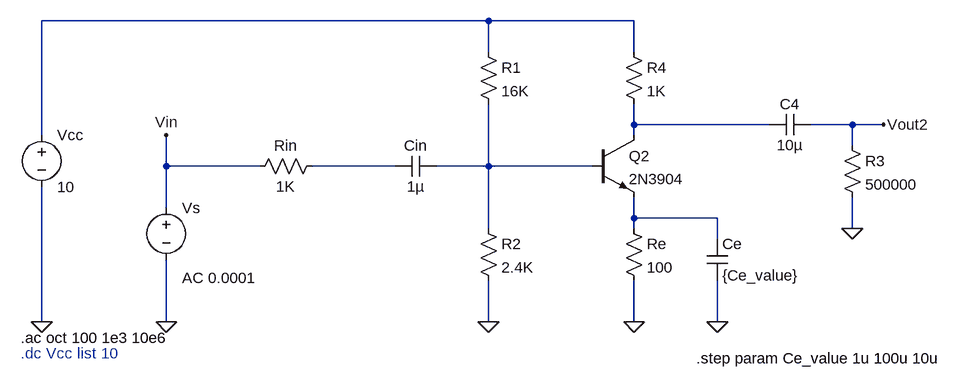
[diagram p0: schematic transistor_common_emitter_ex_ac_gain.asc]
transistor_common_emitter_ex_ac_gain.asc, the LTspice schematic file:
Version 4
SHEET 1 1368 680
WIRE 240 32 -448 32
WIRE 464 32 240 32
WIRE 240 80 240 32
WIRE 464 80 464 32
WIRE 464 192 464 160
WIRE 672 192 464 192
WIRE 800 192 736 192
WIRE 848 192 800 192
WIRE -448 208 -448 32
WIRE 464 208 464 192
WIRE 800 224 800 192
WIRE -256 256 -256 208
WIRE -112 256 -256 256
WIRE 96 256 -32 256
WIRE 240 256 240 160
WIRE 240 256 160 256
WIRE 400 256 240 256
WIRE -256 320 -256 256
WIRE 464 336 464 304
WIRE 592 336 464 336
WIRE 240 352 240 256
WIRE 464 352 464 336
WIRE 800 352 800 304
WIRE 592 368 592 336
WIRE -448 496 -448 288
WIRE -256 496 -256 400
WIRE 240 496 240 432
WIRE 464 496 464 432
WIRE 592 496 592 432
FLAG -256 496 0
FLAG -448 496 0
FLAG -256 208 Vin
FLAG 464 496 0
FLAG 240 496 0
FLAG 848 192 Vout2
FLAG 800 352 0
FLAG 592 496 0
SYMBOL voltage -448 192 R0
WINDOW 123 0 0 Left 0
WINDOW 39 0 0 Left 0
SYMATTR InstName Vcc
SYMATTR Value 10
SYMBOL voltage -256 304 R0
WINDOW 123 24 124 Left 2
WINDOW 39 0 0 Left 0
SYMATTR Value2 AC 0.0001
SYMATTR InstName Vs
SYMATTR Value ""
SYMBOL res 224 64 R0
SYMATTR InstName R1
SYMATTR Value 16K
SYMBOL res 224 336 R0
SYMATTR InstName R2
SYMATTR Value 2.4K
SYMBOL res 448 336 R0
SYMATTR InstName Re
SYMATTR Value 100
SYMBOL npn 400 208 R0
SYMATTR InstName Q2
SYMATTR Value 2N3904
SYMBOL cap 160 240 R90
WINDOW 0 0 32 VBottom 2
WINDOW 3 32 32 VTop 2
SYMATTR InstName Cin
SYMATTR Value 1µ
SYMBOL res -16 240 R90
WINDOW 0 0 56 VBottom 2
WINDOW 3 32 56 VTop 2
SYMATTR InstName Rin
SYMATTR Value 1K
SYMBOL cap 736 176 R90
WINDOW 0 0 32 VBottom 2
WINDOW 3 32 32 VTop 2
SYMATTR InstName C4
SYMATTR Value 10µ
SYMBOL res 784 208 R0
SYMATTR InstName R3
SYMATTR Value 500000
SYMBOL res 448 64 R0
SYMATTR InstName R4
SYMATTR Value 1K
SYMBOL cap 576 368 R0
SYMATTR InstName Ce
SYMATTR Value {Ce_value}
TEXT -480 520 Left 2 !.ac oct 100 1e3 10e6
TEXT -480 544 Left 2 ;.dc Vcc list 10
TEXT 560 552 Left 2 !.step param Ce_value 1u 100u 10u

The netlist it stands for:
* transistor_common_emitter_ex_ac_gain.asc
Vcc N001 0 10
Vs Vin 0 AC 0.0001
R1 N001 N004 16K
R2 N004 0 2.4K
Re N005 0 100
Q2 N002 N004 N005 0 2N3904
Cin N004 N003 1µ
Rin N003 Vin 1K
C4 Vout2 N002 10µ
R3 Vout2 0 500000
R4 N001 N002 1K
Ce N005 0 {Ce_value}
.model NPN NPN
.model PNP PNP
.lib standard.bjt
.ac oct 100 1e3 10e6
* .dc Vcc list 10
.step param Ce_value 1u 100u 10u
.backanno
.end